# Altium schematic sheet OutPut.SchDoc
size A4
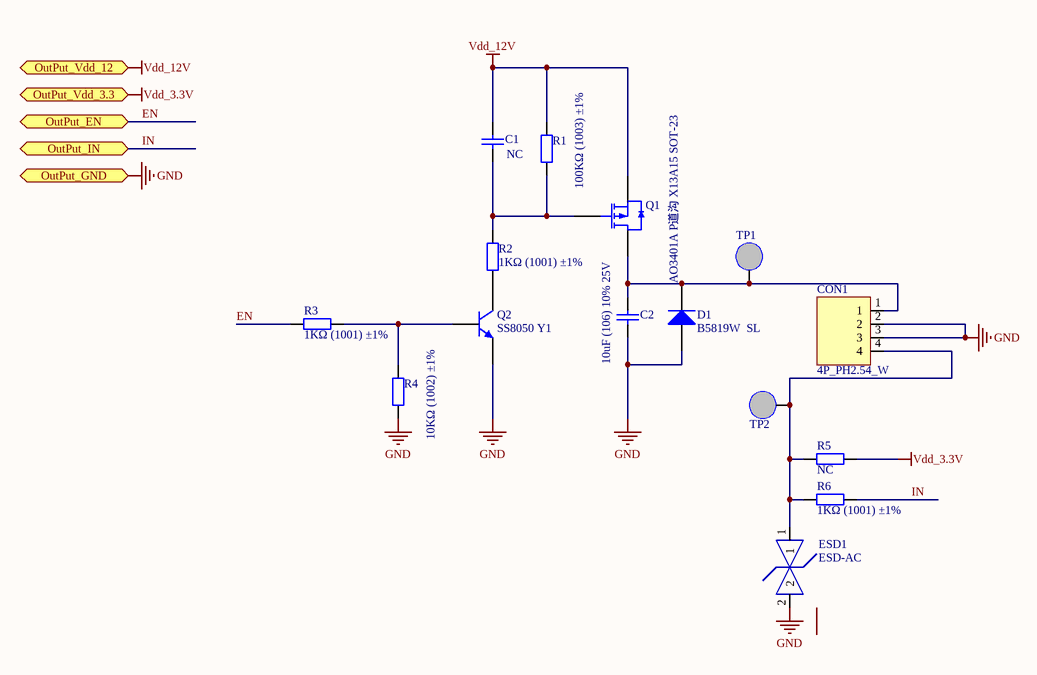
[diagram p0: OutPut.SchDoc]

## Parts
C1  NC  [0805_C]
C2  10uF (106) 10% 25V  [0805_C]
CON1  4P_PH2.54_W  [PH2.0-WS-4P]
D1  B5819W  SL  [SOD-123]
ESD1  ESD-AC  [SOD-523]
Q1  AO3401A P道沟 X13A15 SOT-23  [SOT-23-3L]
Q2  SS8050 Y1  [SOT-23(SOT-23-3)]
R1  100KΩ (1003) ±1%  [0805_R]
R2  1KΩ (1001) ±1%  [0805_R]
R3  1KΩ (1001) ±1%  [0805_R]
R4  10KΩ (1002) ±1%  [0805_R]
R5  NC  [0805_R]
R6  1KΩ (1001) ±1%  [0805_R]
TP1  TP  [TP]  (value not drawn)
TP2  TP  [TP]  (value not drawn)

## Ports
OutPut_EN, OutPut_GND, OutPut_IN, OutPut_Vdd_3.3, OutPut_Vdd_12

## Nets
GND: C2.1 CON1.2 CON1.3 D1.1(A) ESD1.2 Q2.2(E) R4.1 ; port OutPut_GND
Vdd_3.3V: R5.2 ; port OutPut_Vdd_3.3
Vdd_12V: C1.2 Q1.2(S) R1.2 ; port OutPut_Vdd_12
EN: R3.1 ; port OutPut_EN
IN: R6.2 ; port OutPut_IN
NetC1_1: C1.1 Q1.1(G) R1.1 R2.1
NetC2_2: C2.2 CON1.1 D1.2(K) Q1.3(D) TP1.1
NetCON1_4: CON1.4 ESD1.1 R5.1 R6.1 TP2.1
NetQ2_1: Q2.1(B) R3.2 R4.2
NetQ2_3: Q2.3(C) R2.2

Not connected (* = marked no-connect by the designer): CON1 A B

## Library data of the parts
C1 = 0805 22uF (226) 20% 25V: 贴片电容; ComponentLink1Description: 供应商链接; ComponentLink1URL: http://www.szlcsc.com/product/details_46786.html; Package: 0805; Supplier: LC; SuppliersPartNumber: C45783
C2 = 0805 10uF (106) 10% 25V: 贴片电容; ComponentLink1Description: 供应商链接; ComponentLink1URL: http://www.szlcsc.com/product/details_16532.html; Package: 0805; Supplier: LC; SuppliersPartNumber: C15850
CON1 = 4P_XH2.54_W
D1 = SOD-123 B5819W  SL: 肖特基二极管; ComponentLink1Description: 供应商链接; ComponentLink1URL: http://www.szlcsc.com/product/details_9093.html; Package: SOD-123; Supplier: LC; SuppliersPartNumber: C8598
Q1 = AO3401A P道沟 X13A15 SOT-23: MOS(场效应管); ComponentLink1Description: 供应商链接; ComponentLink1URL: http://www.szlcsc.com/product/details_15801.html; Package: SOT-23; Supplier: LC; SuppliersPartNumber: C15127
Q2 = SOT-23 SS8050 Y1: 三极管; ComponentLink1Description: 供应商链接; ComponentLink1URL: http://www.szlcsc.com/product/details_2507.html; Package: SOT-23; Supplier: LC; SuppliersPartNumber: C2150
R1 = 0805 100KΩ (1003) 1%: 贴片电阻; ComponentLink1Description: 供应商链接; ComponentLink1URL: http://www.szlcsc.com/product/details_18095.html; Package: 0805; Supplier: LC; SuppliersPartNumber: C17407
R2 R3 R5 R6 = 0805 1KΩ (1001) 1%: 贴片电阻; ComponentLink1Description: 供应商链接; ComponentLink1URL: http://www.szlcsc.com/product/details_18201.html; Package: 0805; Supplier: LC; SuppliersPartNumber: C17513
R4 = 0805 10KΩ (1002) 1%: 贴片电阻; ComponentLink1Description: 供应商链接; ComponentLink1URL: http://www.szlcsc.com/product/details_18102.html; Package: 0805; Supplier: LC; SuppliersPartNumber: C17414